# Altium schematic sheet Equivalent Resistance ISET.SchDoc
size A; SheetNumber: 1; SheetTotal: 3
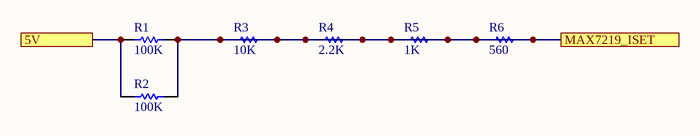
[diagram p0: Equivalent Resistance ISET.SchDoc]

## Parts
R1  value 100K  (hidden comment: Resistor)
R2  value 100K  (hidden comment: Resistor)
R3  value 10K  (hidden comment: Resistor)
R4  value 2.2K  (hidden comment: Resistor)
R5  value 1K  (hidden comment: Resistor)
R6  value 560  (hidden comment: Resistor)

## Ports
5V (see Equivalent Resistance RFBT 3V3[1B]), MAX7219_ISET (see Equivalent Resistance RFBT 3V3[3B])

## Nets
5V: R1.1 R2.2 ; port 5V
MAX7219_ISET: R1.2 R2.1 R3.1 R3.2 R4.1 R4.2 R5.1 R5.2 R6.1 R6.2 ; port MAX7219_ISET

## Library data of the parts
R1-R6 = Resistor: TC1: 0; SimulationGenericComponent: True; TC2: 0